# EAGLE design Tablet_LPF (EAGLE 7.2.0)
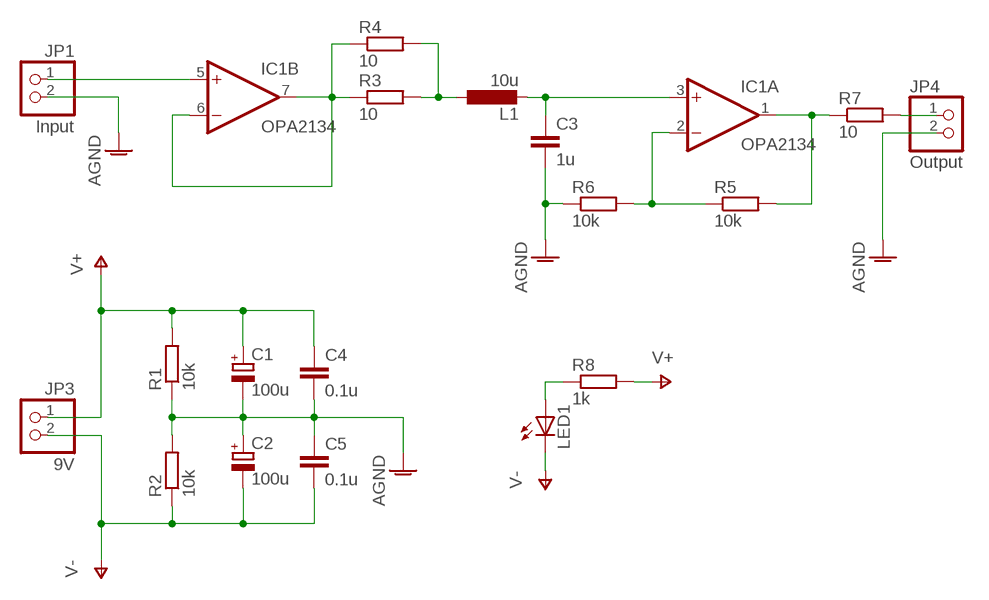
[diagram p0: schematic, sheet 1]

## Parts
C1  100u  CPOL-EUE2.5-7  [E2,5-7]
C2  100u  CPOL-EUE2.5-7  [E2,5-7]
C3  1u  C-EU050-045X075  [C050-045X075]
C4  0.1u  C-EU025-024X044  [C025-024X044]
C5  0.1u  C-EU025-024X044  [C025-024X044]
IC1  OPA2134  LM358N  [DIL08]
JP1  Input  PINHD-1X2  [1X02]
JP3  9V  PINHD-1X2  [1X02]
JP4  Output  PINHD-1X2  [1X02]
L1  10u  L-EU6000-XXX-RC  [6000-XXXX-RC]
LED1  LED3MM  [LED3MM]
R1  10k  R-EU_0207/7  [0207/7]
R2  10k  R-EU_0207/7  [0207/7]
R3  10  R-EU_0207/7  [0207/7]
R4  10  R-EU_0207/7  [0207/7]
R5  10k  R-EU_0207/7  [0207/7]
R6  10k  R-EU_0207/7  [0207/7]
R7  10  R-EU_0207/7  [0207/7]
R8  1k  R-EU_0207/7  [0207/7]

## Nets
AGND: C1.- C2.+ C3.2 C4.2 C5.1 JP1.2 JP4.2 R1.1 R2.2 R6.1
N$1: LED1.A R8.1
N$2: IC1.5(B:+IN) JP1.1
N$3: IC1.6(B:-IN) IC1.7(B:OUT) R3.1 R4.1
N$4: L1.1 R3.2 R4.2
N$5: C3.1 IC1.3(A:+IN) L1.2
N$6: JP4.1 R7.2
N$7: IC1.1(A:OUT) R5.2 R7.1
N$8: IC1.2(A:-IN) R5.1 R6.2
V+: C1.+ C4.1 JP3.1 R1.2 R8.2
V-: C2.- C5.2 JP3.2 LED1.K(C) R2.1

## Power pins joined to a net without a drawn wire
V+: IC1.8(P:V+)
V-: IC1.4(P:V-)

## Library data of the parts
C1 C2 = rcl:CPOL-EU: POLARIZED CAPACITOR, European symbol
C3-C5 = rcl:C-EU: CAPACITOR, European symbol
IC1 = linear:LM358: OP AMP also LM158; LM258; LM2904 Source: http://cache.national.com/ds/LM/LM158.pdf
JP1 JP3 JP4 = pinhead:PINHD-1X2: PIN HEADER
L1 = rcl:L-EU: INDUCTOR, European symbol
LED1 = led:LED: LED OSRAM: - CHIPLED LG R971, LG N971, LY N971, LG Q971, LY Q971, LO R971, LY R971 LH N974, LH R974 LS Q976, LO Q976, LY Q976 LO Q996 - Hyper CHIPLED LW Q18S LB Q993, LB Q99A, LB R99A - SideLED LS A670, LO A670, LY A670, LG A670, LP A670 LB A673, LV A673, LT A673, LW A673 LH A674 LY A675 LS A676, LA A676, LO A676, LY A676, LW A676 LS A679, LY A679, LG A679 - Hyper Micro SIDELED® LS Y876, LA Y876, LO Y876, LY Y876 LT Y87S - SmartLED LW L88C, LW L88S LB L89C, LB L89S, LG L890 LS L89K, LO L89K, LY L89K LS L896, LA L896, LO L896, LY L896 - TOPLED LS T670, LO T670, LY T670, LG T670, LP T670 LSG T670, LSP T670, LSY T670, LOP T670, LYG T670 LG T671, LOG T671, LSG T671 LB T673, LV T673, LT T673, LW T673 LH T674 LS T676, LA T676, LO T676, LY T676, LB T676, LH T676, LSB T676, LW T676 LB T67C, LV T67C, LT T67C, LS T67K, LO T67K, LY T67K, LW E67C LS E67B, LA E67B, LO E67B, LY E67B, LB E67C, LV E67C, LT E67C LW T67C LS T679, LY T679, LG T679 LS T770, LO T770, LY T770, LG T770, LP T770 LB T773, LV T773, LT T773, LW T773 LH T774 LS E675, LA E675, LY E675, LS T675 LS T776, LA T776, LO T776, LY T776, LB T776 LHGB T686 LT T68C, LB T68C - Hyper Mini TOPLED® LB M676 - Mini TOPLED Santana® LG M470 LS M47K, LO M47K, LY M47K Source: http://www.osram.convergy.de LUXEON: - LUMILED® LXK2-PW12-R00, LXK2-PW12-S00, LXK2-PW14-U00, LXK2-PW14-V00 LXK2-PM12-R00, LXK2-PM12-S00, LXK2-PM14-U00 LXK2-PE12-Q00, LXK2-PE12-R00, LXK2-PE12-S00, LXK2-PE14-T00, LXK2-PE14-U00 LXK2-PB12-K00, LXK2-PB12-L00, LXK2-PB12-M00, LXK2-PB14-N00, LXK2-PB14-P00, LXK2-PB14-Q00 LXK2-PR12-L00, LXK2-PR12-M00, LXK2-PR14-Q00, LXK2-PR14-R00 LXK2-PD12-Q00, LXK2-PD12-R00, LXK2-PD12-S00 LXK2-PH12-R00, LXK2-PH12-S00 LXK2-PL12-P00, LXK2-PL12-Q00, LXK2-PL12-R00 Source: www.luxeon.com KINGBRIGHT: KA-3528ASYC Source: www.kingbright.com
R1-R8 = rcl:R-EU_: RESISTOR, European symbol

## Board
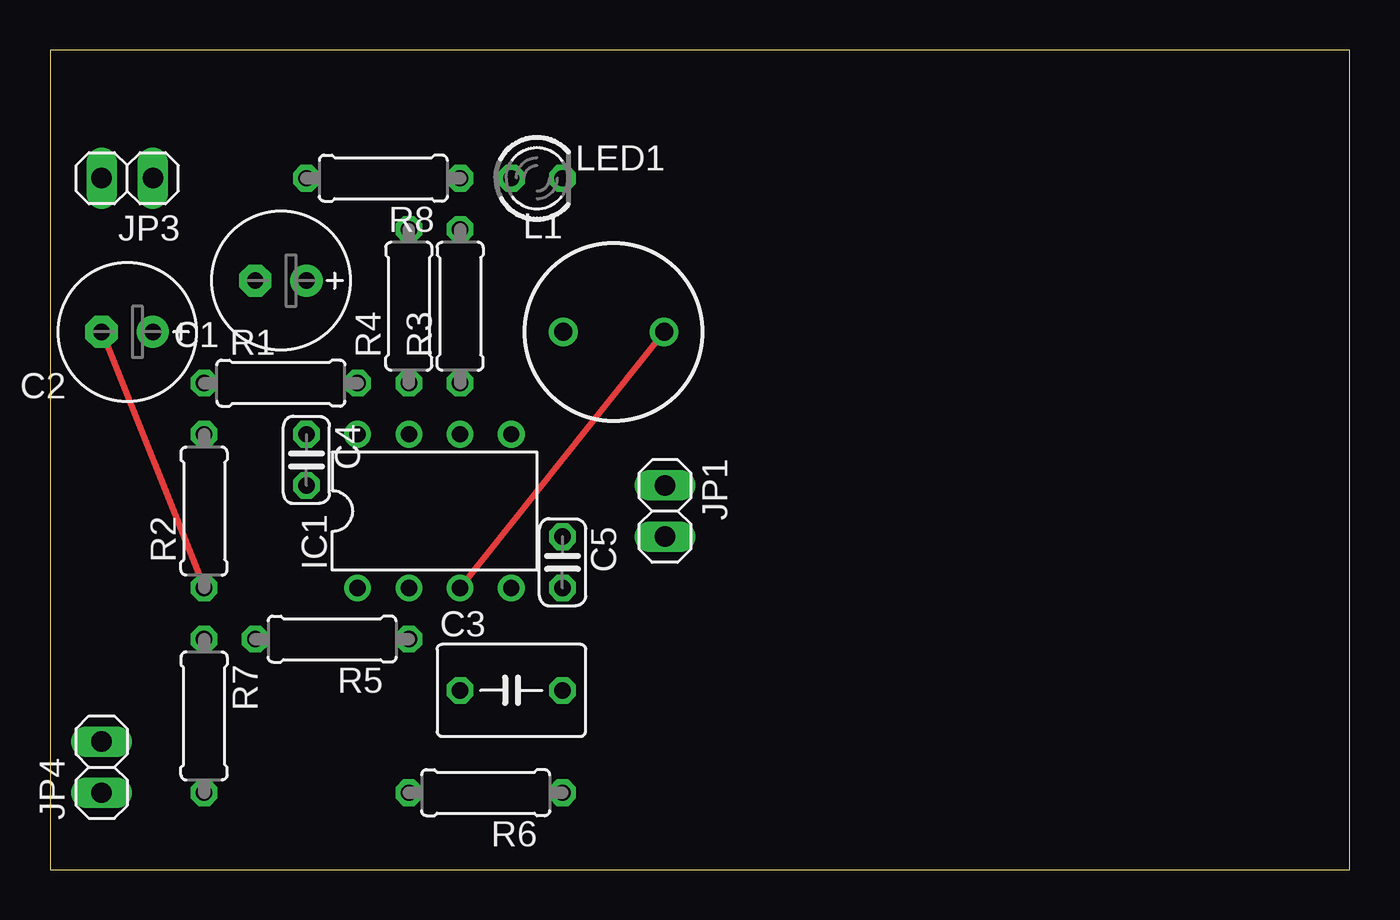
[diagram p1: board, top side]
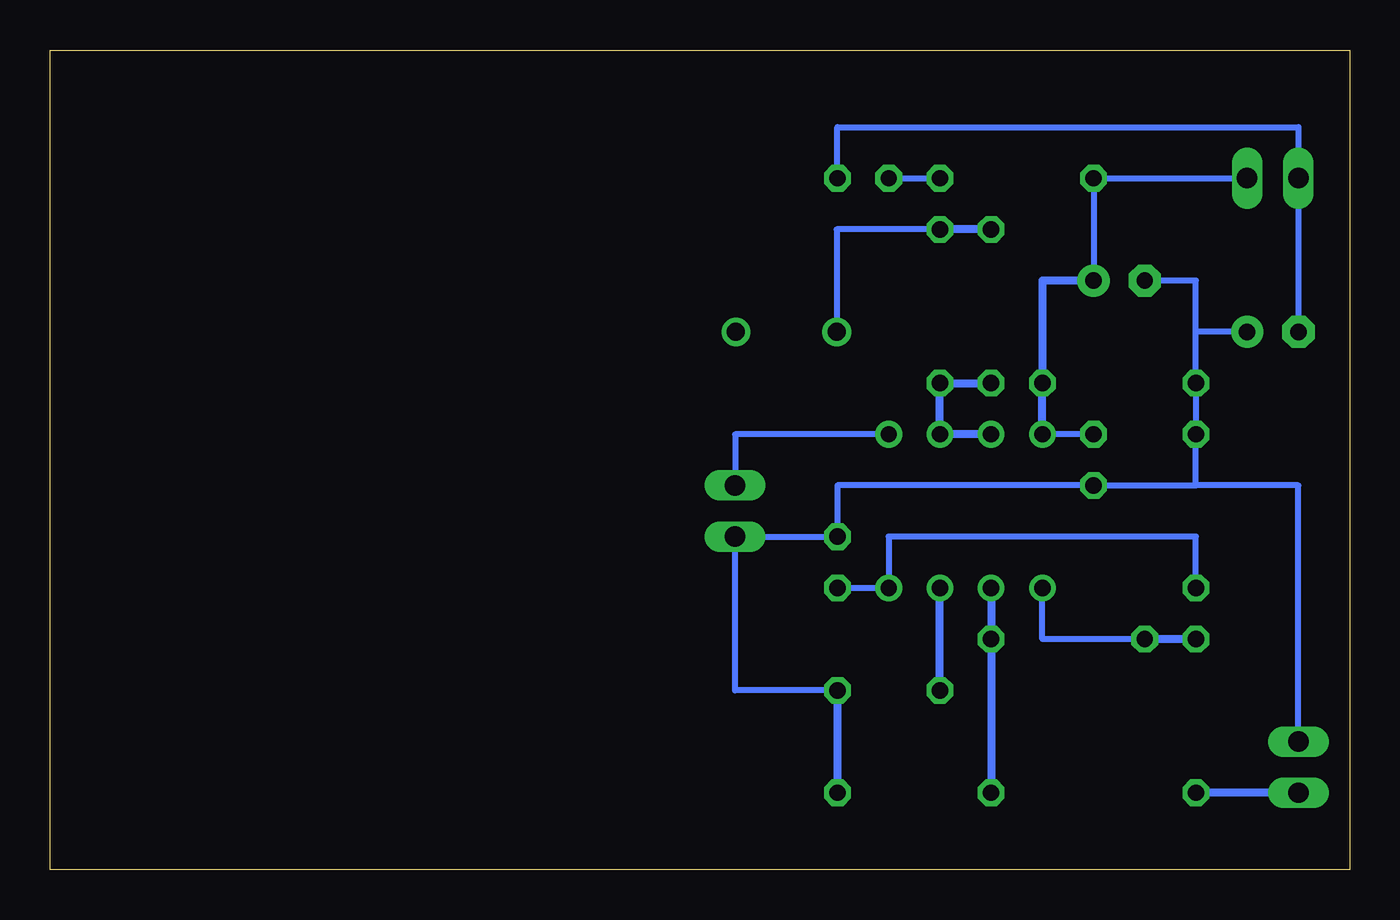
[diagram p2: board, bottom side, seen from below]

Size 64.44 x 40.63 mm. Coordinates in mm from the lower left corner, seen from the top.
Outline: 0,0 64.44,0 64.44,40.63 0,40.63 0,0
Copper layers (1*16): Top 0.035mm / dielectric 1.5mm / Bottom 0.035mm
Design rules "default": minimum track width 10mil, minimum drill 24mil, track to track 8mil, track to pad 8mil, pad to pad 8mil, via to via 8mil, smd to smd 8mil, copper to edge 40mil, drill to drill 8mil, minimum pad ring 10mil, minimum via ring 8mil, stop-mask expansion 4mil, vias tented up to drill 0mil, thermal gap 10mil

### Footprints (pad centres in the part's own frame; a part is rotated, then mirrored left to right if it is on the bottom)
E2,5-7 = drill 0.813 pad 1.6: + -1.27,0 | drill 0.813 pad 1.6 octagon: - 1.27,0
C050-045X075 = drill 0.813 octagon: 1 -2.54,0; 2 2.54,0
C025-024X044 = drill 0.813 octagon: 1 -1.27,0; 2 1.27,0
DIL08 = drill 0.813 pad 1.27: 1 -3.81,-3.81; 2 -1.27,-3.81; 3 1.27,-3.81; 4 3.81,-3.81; 5 3.81,3.81; 6 1.27,3.81; 7 -1.27,3.81; 8 -3.81,3.81
1X02 = drill 1.016 long: 1 -1.27,0; 2 1.27,0
6000-XXXX-RC = drill 0.9 pad 1.422: 1 -2.5,0; 2 2.5,0
LED3MM = drill 0.813 octagon: A -1.27,0; K 1.27,0
0207/7 = drill 0.813 octagon: 1 -3.81,0; 2 3.81,0

### Placement (x,y rotation side)
C1  11.43,29.21 180 top
C2  3.81,26.67 180 top
C3  22.86,8.89 0 top
C4  12.7,20.32 270 top
C5  25.4,15.24 270 top
IC1  19.05,17.78 0 top
JP1  30.48,17.78 270 top
JP3  3.81,34.29 180 top
JP4  2.54,5.08 90 top
L1  27.94,26.67 0 top
LED1  24.13,34.29 0 top
R1  11.43,24.13 0 top
R2  7.62,17.78 90 top
R3  20.32,27.94 90 top
R4  17.78,27.94 90 top
R5  13.97,11.43 180 top
R6  21.59,3.81 180 top
R7  7.62,7.62 270 top
R8  16.51,34.29 180 top

### Tracks (layer width: path | path; a pad name or v marks a point on that pad's centre or on a via)
AGND
  Bottom 0.305: C3.2 30.48,8.89 JP1.2 C5.1 25.4,19.05 C4.2 7.62,19.05 | 7.62,26.67 R1.1 R2.2 7.62,19.05 | 7.62,26.67 7.62,29.21 C1.- | C2.+ 7.62,26.67 | JP4.2 2.54,19.05 7.62,19.05
  Bottom 0.406: C3.2 R6.1
N$1
  Bottom 0.305: LED1.A R8.1
N$2
  Bottom 0.305: IC1.5 30.48,21.59 JP1.1
N$3
  Bottom 0.406: IC1.7 IC1.6 R3.1 R4.1
N$4
  Bottom 0.305: R3.2 25.44,31.75 L1.1
  Bottom 0.406: R4.2 R3.2
N$5
  Top 0.305: IC1.3 L1.2
  Bottom 0.406: C3.1 IC1.3
N$6
  Bottom 0.406: JP4.1 R7.2
N$7
  Bottom 0.305: R5.2 15.24,11.43 IC1.1
  Bottom 0.406: R7.1 R5.2
N$8
  Bottom 0.406: IC1.2 R5.1 R6.2
V+
  Bottom 0.305: C4.1 IC1.8 | C1.+ R8.2 JP3.1
  Bottom 0.406: IC1.8 R1.2 15.24,29.21 C1.+
V-
  Top 0.305: C2.- R2.1
  Bottom 0.305: C5.2 IC1.4 22.86,16.51 7.62,16.51 R2.1 | C2.- JP3.2 2.54,36.83 25.4,36.83 LED1.K